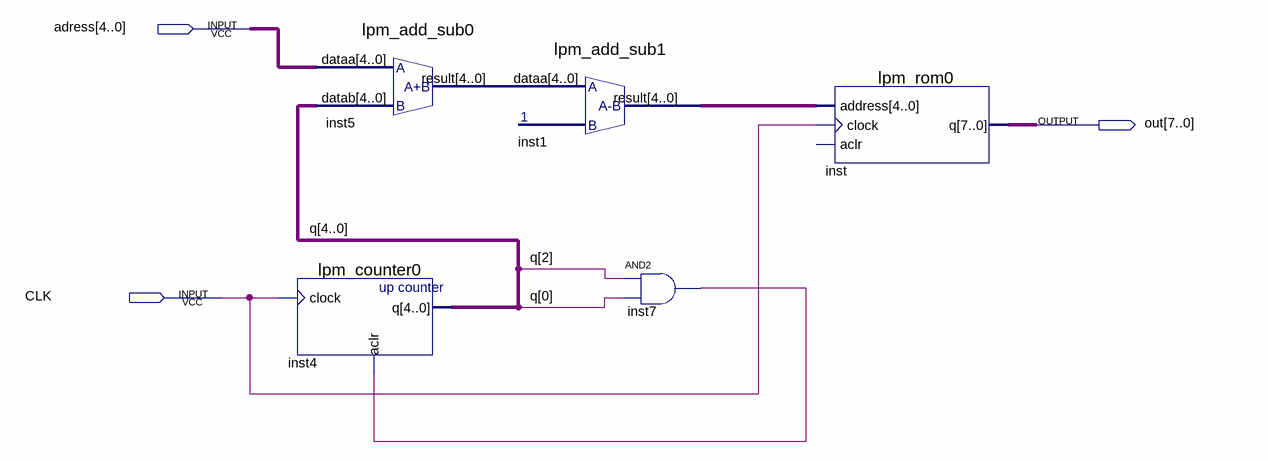
[diagram p0: schematic sheet]
// Quartus schematic rom_block.bdf as structural Verilog: 5 symbols, 3 pins
module rom_block (
  input  [4:0] adress,
  input  CLK,
  output [7:0] out
);

  wire inst7_out;
  wire [4:0] inst1_result, inst5_result, q;

  lpm_add_sub0 inst5 (.dataa(adress), .datab(q), .result(inst5_result));
  lpm_counter0 inst4 (.clock(CLK), .aclr(inst7_out), .q(q));
  lpm_add_sub1 inst1 (.dataa(inst5_result), .result(inst1_result));
  and inst7 (inst7_out, q[2], q[0]);
  lpm_rom0 inst (.address(inst1_result), .clock(CLK), .q(out));  // open: aclr
endmodule
